# EAGLE design Schatten3 (EAGLE 6.5.0)
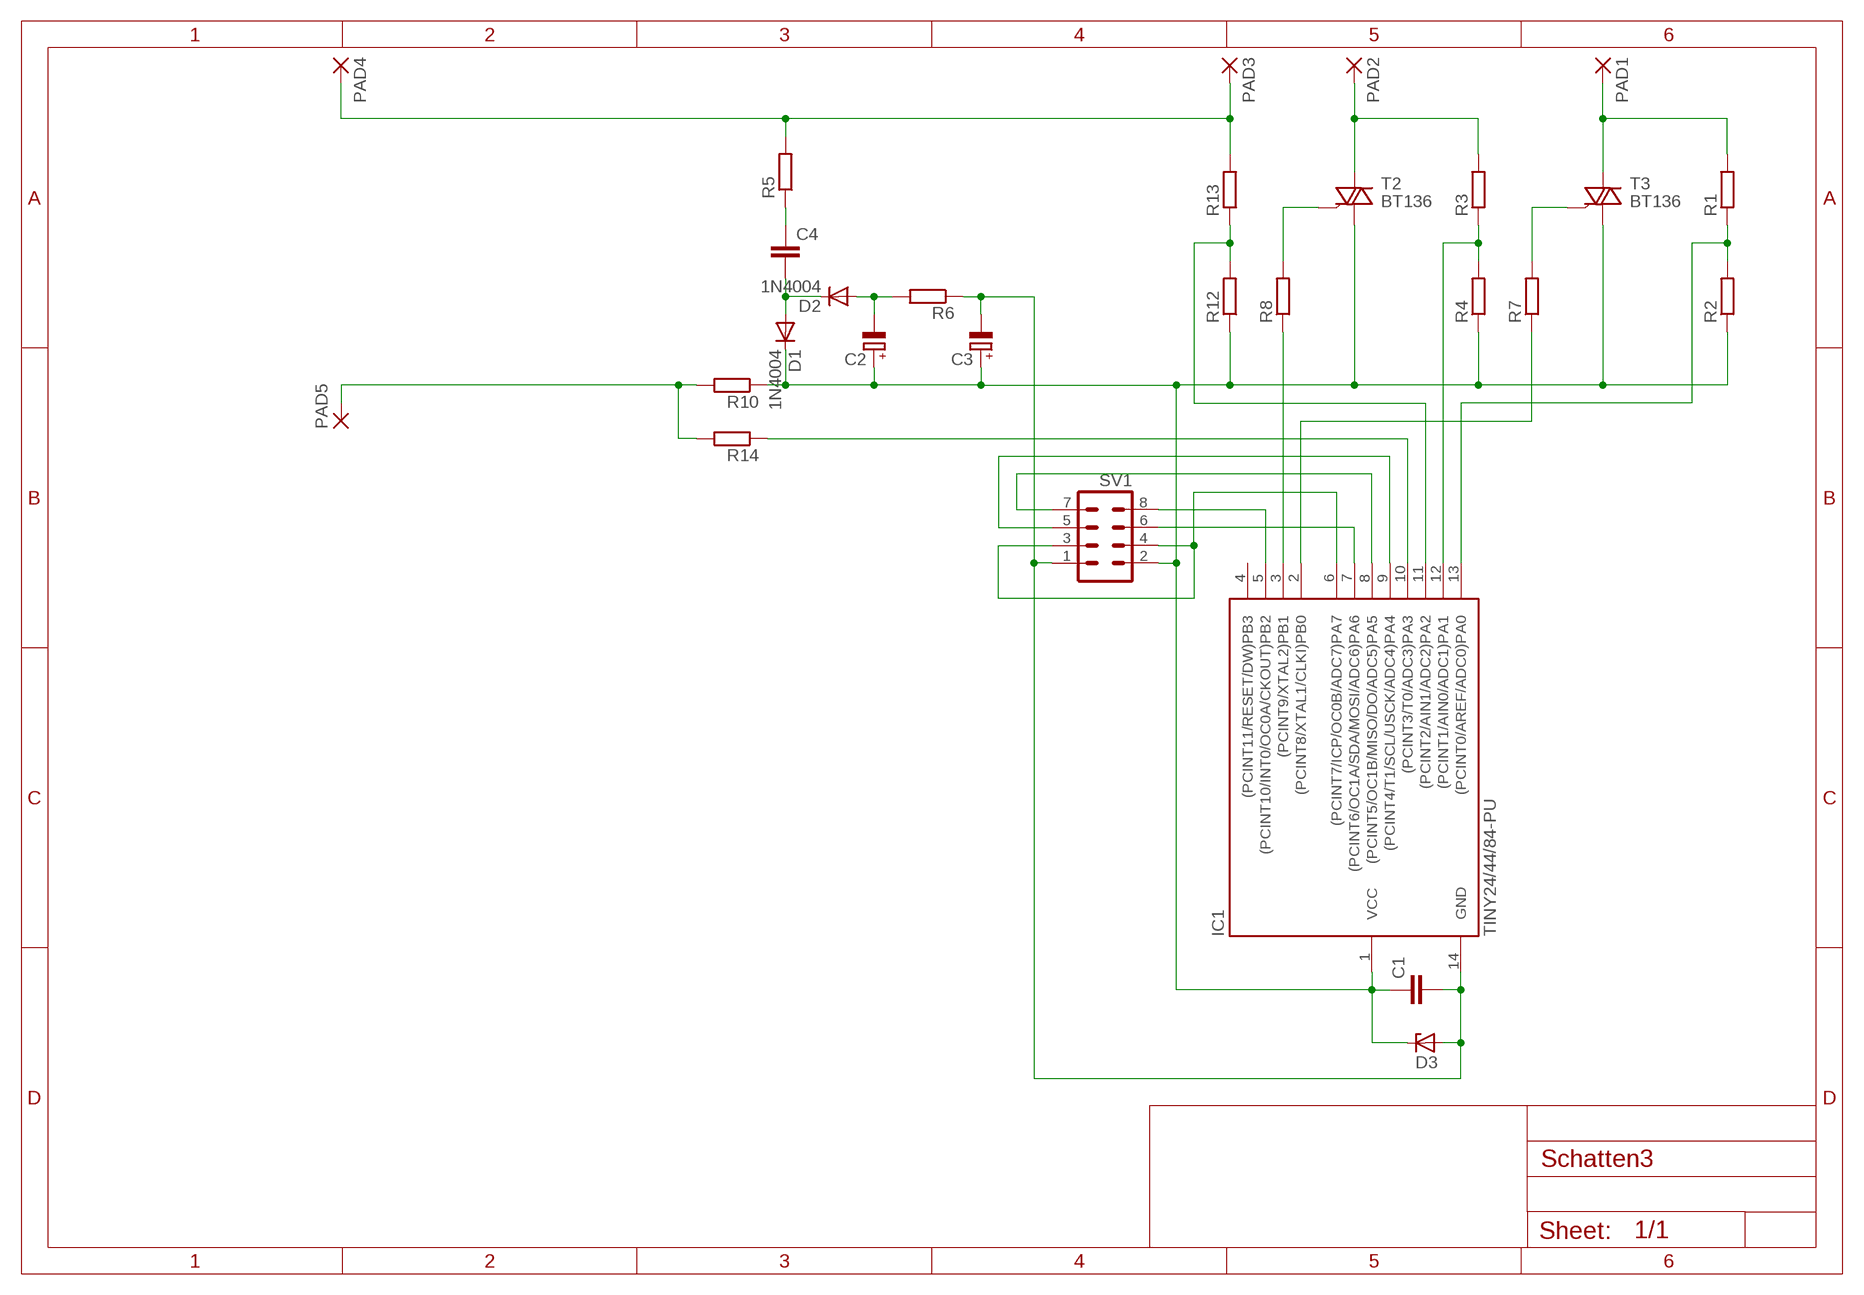
[diagram p0: schematic, sheet 1]

## Parts
C1  C-EUC3225  [C3225]
C2  CPOL-EUE5-8.5  [E5-8,5]
C3  CPOL-EUE5-8.5  [E5-8,5]
C4  C-EU150-064X183  [C150-064X183]
D1  1N4004  [DO41-10]
D2  1N4004  [DO41-10]
D3  ZENER-DIODEZD-7.5  [ZDIO-7.5]
IC1  TINY24/44/84-PU  [DIL14]
PAD1  1,6/0,9  [1,6/0,9]
PAD2  1,6/0,9  [1,6/0,9]
PAD3  1,6/0,9  [1,6/0,9]
PAD4  1,6/0,9  [1,6/0,9]
PAD5  1,6/0,9  [1,6/0,9]
R1  R-EU_0207/10  [0207/10]
R2  R-EU_0207/10  [0207/10]
R3  R-EU_0207/10  [0207/10]
R4  R-EU_0207/10  [0207/10]
R5  R-EU_0207/10  [0207/10]
R6  R-EU_0207/10  [0207/10]
R7  R-EU_0207/10  [0207/10]
R8  R-EU_0207/10  [0207/10]
R10  R-EU_0207/10  [0207/10]
R12  R-EU_0207/10  [0207/10]
R13  R-EU_0207/10  [0207/10]
R14  R-EU_0207/10  [0207/10]
SV1  MA04-2  [MA04-2]
T2  BT136  [TO220AB]
T3  BT136  [TO220AB]

## Nets
N$1: PAD5.1(P) R10.2 R14.2
N$2: IC1.13((PCINT0/AREF/ADC0)PA0) R1.1 R2.2
N$3: IC1.10((PCINT3/T0/ADC3)PA3) R14.1
N$4: IC1.7((PCINT6/OC1A/SDA/MOSI/ADC6)PA6) SV1.6
N$5: IC1.12((PCINT1/AIN0/ADC1)PA1) R3.1 R4.2
N$6: IC1.2((PCINT8/XTAL1/CLKI)PB0) R7.1
N$7: PAD1.1(P) R1.2 T3.2(A2)
N$8: PAD2.1(P) R3.2 T2.2(A2)
N$9: IC1.3((PCINT9/XTAL2)PB1) R8.1
N$10: IC1.8((PCINT5/OC1B/MISO/DO/ADC5)PA5) SV1.7
N$11: R8.2 T2.3(G)
N$12: R7.2 T3.3(G)
N$13: IC1.11((PCINT2/AIN1/ADC2)PA2) R12.2 R13.1
N$14: IC1.9((PCINT4/T1/SCL/USCK/ADC4)PA4) SV1.5
N$15: IC1.5((PCINT10/INT0/OC0A/CKOUT)PB2) SV1.8
N$16: IC1.6((PCINT7/ICP/OC0B/ADC7)PA7) SV1.3 SV1.4
N$17: PAD3.1(P) PAD4.1(P) R5.2 R13.2
N$18: C1.1 C2.+ C3.+ D1.C D3.C IC1.1(VCC) R2.1 R4.1 R10.1 R12.1 SV1.2 T2.1(A1) T3.1(A1)
N$19: C4.1 R5.1
N$20: C4.2 D1.A D2.C
N$21: C2.- D2.A R6.2
N$22: C1.2 C3.- D3.A IC1.14(GND) R6.1 SV1.1
Unconnected: IC1.4((PCINT11/RESET/DW)PB3)

## Library data of the parts
C1 C4 = rcl:C-EU: CAPACITOR, European symbol
C2 C3 = rcl:CPOL-EU: POLARIZED CAPACITOR, European symbol
D1 D2 = diode:1N4004: DIODE general purpose rectifier, 1 A
D3 = diode:ZENER-DIODE: Z-Diode
IC1 = avr-5-4.16:TINY24/44/84
PAD1-PAD5 = wirepad:1,6/0,9: THROUGH-HOLE PAD
R1-R8 R10 R12-R14 = rcl:R-EU_: RESISTOR, European symbol
SV1 = con-lstb:MA04-2: PIN HEADER; OC_FARNELL: unknown; OC_NEWARK: unknown
T2 T3 = triac:BT136: Triac BT136 series E sensitive gate Source: http://www.nxp.com/acrobat_download/datasheets/BT136_SERIES_E_2.pdf

## Board
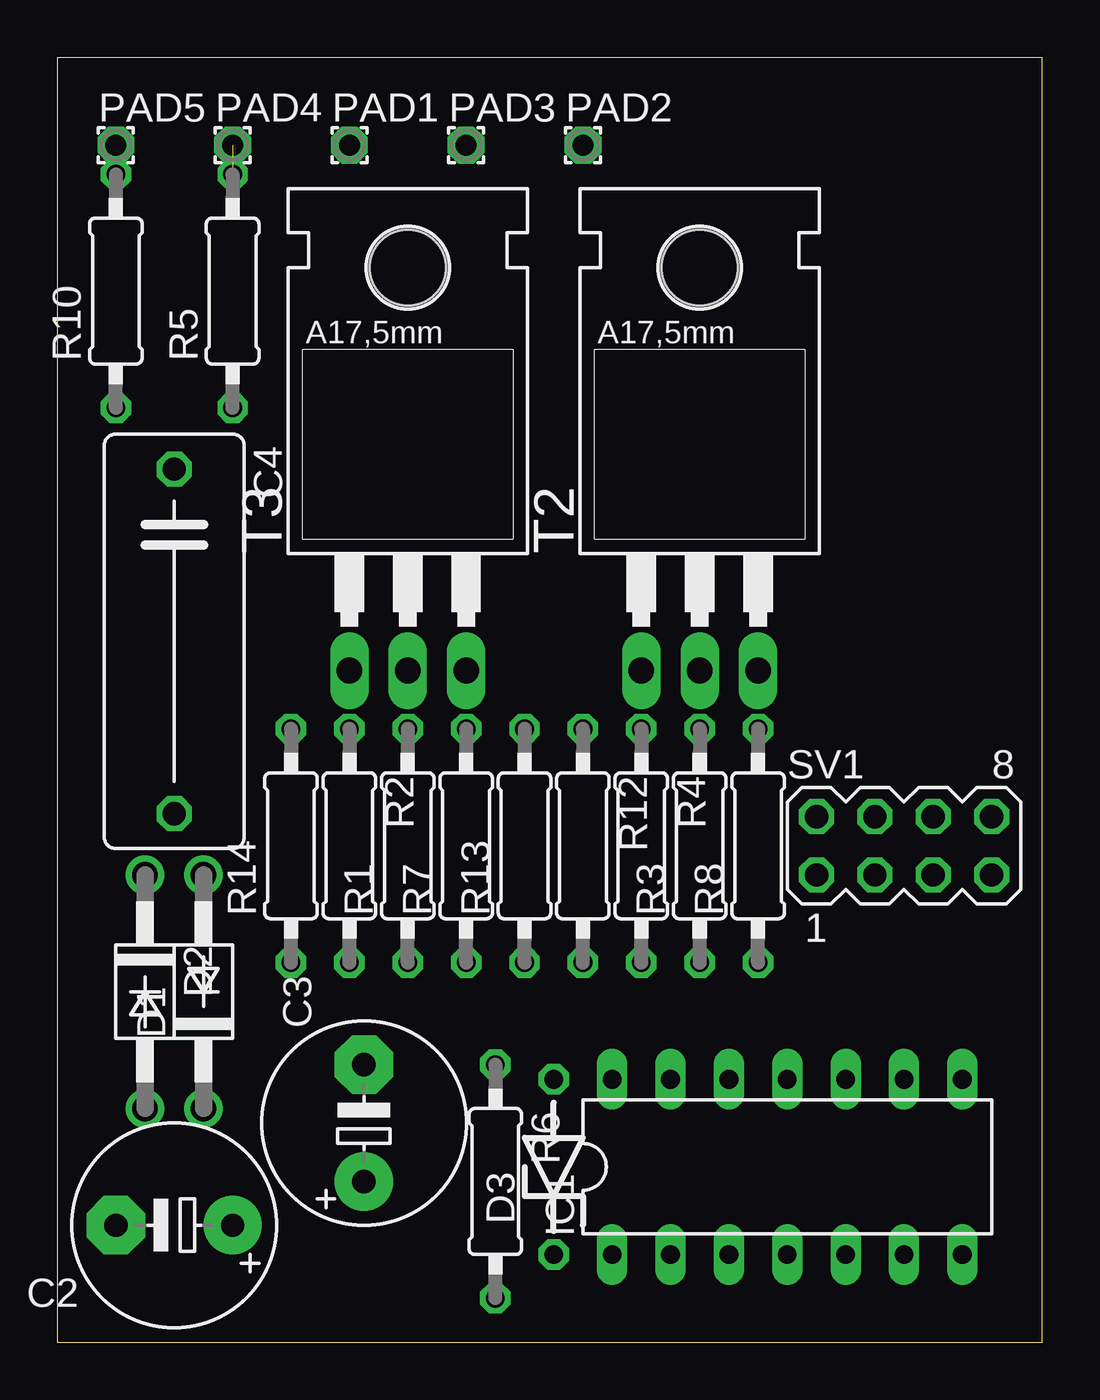
[diagram p1: board, top side]
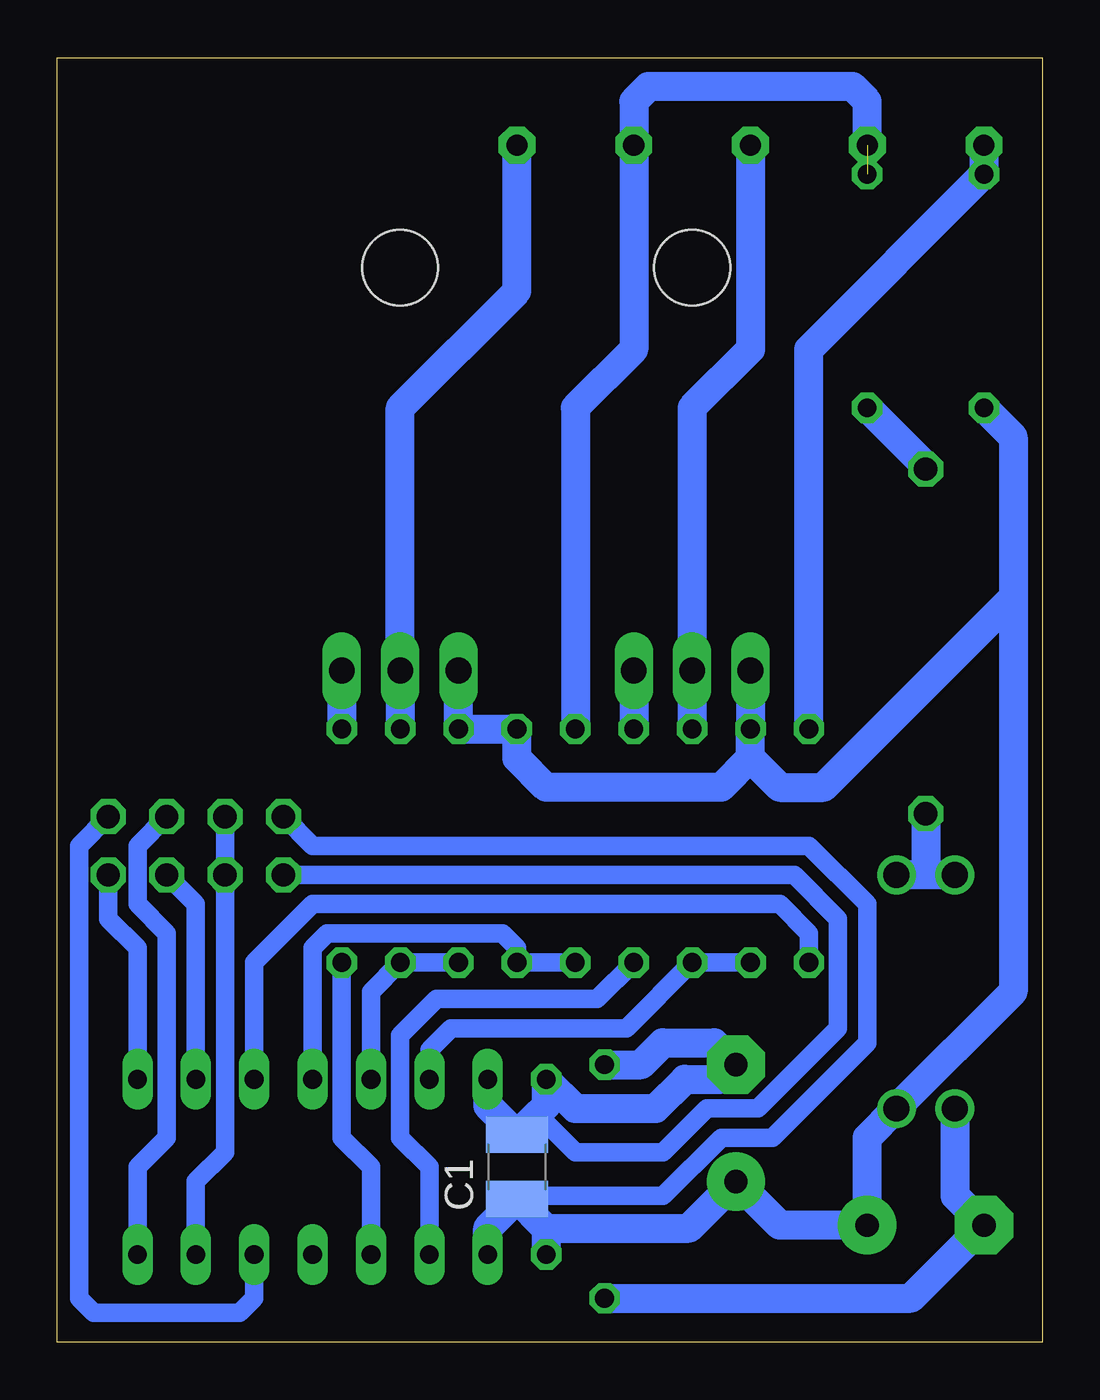
[diagram p2: board, bottom side, seen from below]

Size 42.85 x 55.87 mm. Coordinates in mm from the lower left corner, seen from the top.
Outline: 0,0 42.85,0 42.85,55.87 0,55.87 0,0
Copper layers (1*16): Top 0.035mm / dielectric 1.5mm / Bottom 0.035mm
Design rules "default": minimum track width 10mil, minimum drill 0.6mm, track to track 8mil, track to pad 8mil, pad to pad 8mil, via to via 8mil, smd to smd 8mil, copper to edge 40mil, drill to drill 8mil, minimum pad ring 10mil, minimum via ring 8mil, stop-mask expansion 4mil, vias tented up to drill 0mil, thermal gap 10mil

### Footprints (pad centres in the part's own frame; a part is rotated, then mirrored left to right if it is on the bottom)
C3225 = smd 1.6 x 2.7: 1 -1.4,0; 2 1.4,0
E5-8,5 = drill 1.016 pad 2.54: + -2.54,0 | drill 1.016 pad 2.54 octagon: - 2.54,0
C150-064X183 = drill 1.016 octagon: 1 -7.493,0; 2 7.493,0
DO41-10 = drill 1.118: A 5.08,0; C -5.08,0
ZDIO-7.5 = drill 0.813 octagon: A 3.81,0; C -3.81,0
DIL14 = drill 0.813 long: 1 -7.62,-3.81; 2 -5.08,-3.81; 3 -2.54,-3.81; 4 0,-3.81; 5 2.54,-3.81; 6 5.08,-3.81; 7 7.62,-3.81; 8 7.62,3.81; 9 5.08,3.81; 10 2.54,3.81; 11 0,3.81; 12 -2.54,3.81; 13 -5.08,3.81; 14 -7.62,3.81
1,6/0,9 = drill 0.914 pad 1.6 octagon: 1 0,0
0207/10 = drill 0.813 octagon: 1 -5.08,0; 2 5.08,0
MA04-2 = drill 1.016 octagon: 1 -3.81,-1.27; 2 -3.81,1.27; 3 -1.27,-1.27; 4 -1.27,1.27; 5 1.27,-1.27; 6 1.27,1.27; 7 3.81,-1.27; 8 3.81,1.27
TO220AB = drill 1.118 long: 1 -2.54,-6.35; 2 0,-6.35; 3 2.54,-6.35 | hole 3.302: 0,11.176

### Placement (x,y rotation side)
C1  22.86,7.62 90 bottom
C2  5.08,5.08 180 top
C3  13.34,9.53 90 top
C4  5.08,30.48 270 top
D1  6.35,15.24 90 top
D2  3.81,15.24 270 top
D3  21.59,7.62 90 top
IC1  31.75,7.62 0 top
PAD1  12.7,52.07 0 top
PAD2  22.86,52.07 0 top
PAD3  17.78,52.07 0 top
PAD4  7.62,52.07 0 top
PAD5  2.54,52.07 0 top
R1  15.24,21.59 90 top
R2  12.7,21.59 270 top
R3  27.94,21.59 90 top
R4  25.4,21.59 270 top
R5  7.62,45.72 90 top
R6  19.05,6.99 270 top
R7  17.78,21.59 90 top
R8  30.48,21.59 90 top
R10  2.54,45.72 90 top
R12  22.86,21.59 270 top
R13  20.32,21.59 90 top
R14  10.16,21.59 90 top
SV1  36.83,21.59 0 top
T2  27.94,35.56 0 top
T3  15.24,35.56 0 top

### Tracks (layer width: path | path; a pad name or v marks a point on that pad's centre or on a via)
N$1
  Bottom 1.27: PAD5.1 R10.2 10.16,43.18 R14.2
N$2
  Bottom 0.813: R2.2 R1.1 18.1,13.65 25.72,13.65 26.67,12.7 IC1.13
N$3
  Bottom 0.813: IC1.10 34.29,16.51 31.75,19.05 11.43,19.05 10.16,17.78 R14.1
N$4
  Bottom 0.813: IC1.7 39.37,7.62 38.1,8.89 38.1,17.78 39.37,19.05 39.37,21.59 SV1.6
N$5
  Bottom 0.813: R4.2 R3.1 29.21,15.24 IC1.12
N$6
  Bottom 0.813: IC1.2 26.67,7.62 27.94,8.89 27.94,13.34 26.35,14.92 19.37,14.92 R7.1
N$7
  Bottom 1.27: R1.2 T3.2 15.24,40.64 12.7,43.18 PAD1.1
N$8
  Bottom 1.27: R3.2 T2.2 27.94,40.64 22.86,45.72 PAD2.1
N$9
  Bottom 0.813: IC1.3 29.21,7.62 30.48,8.89 R8.1
N$10
  Bottom 0.813: IC1.8 39.37,17.14 40.64,18.41 SV1.7
N$11
  Bottom 1.27: T2.3 R8.2
N$12
  Bottom 1.27: T3.3 R7.2
N$13
  Bottom 0.813: R13.1 R12.2 22.86,17.14 23.5,17.78 31.11,17.78 31.75,17.14 IC1.11
N$14
  Bottom 0.813: IC1.9 36.83,19.05 SV1.5
N$15
  Bottom 0.813: SV1.8 41.91,21.59 41.91,1.91 41.27,1.27 34.92,1.27 34.29,1.91 IC1.5
N$16
  Bottom 0.813: IC1.6 36.83,6.99 35.56,8.26 SV1.3 SV1.4
N$17  (1 unrouted)
  Bottom 1.27: PAD4.1 7.62,53.98 8.26,54.61 17.14,54.61 17.78,53.98 PAD3.1 17.78,43.18 20.32,40.64 R13.2
N$18
  Bottom 0.813: C1.1 22.73,6.35 16.51,6.35 13.97,8.89 11.75,8.89 7.62,13.02 7.62,19.05 10.16,21.59 31.75,21.59 SV1.2
  Bottom 1.27: IC1.1 24.13,4.95 C1.1 21.59,4.95 | T3.1 R2.1 12.7,25.4 | 12.7,25.4 13.97,24.13 21.59,24.13 22.86,25.4 R12.1 R4.1 T2.1 | 21.59,4.95 D3.C | 12.7,25.4 11.43,24.13 9.53,24.13 1.27,32.38 | 21.59,4.95 15.37,4.95 C3.+ 11.43,5.08 C2.+ 7.62,8.89 D1.C 1.27,15.24 1.27,32.38 | R10.1 1.27,39.37 1.27,32.38
N$19
  Bottom 1.27: C4.1 5.08,38.1 R5.1
N$20
  Bottom 1.27: D2.C 5.08,20.32 | 5.08,20.32 D1.A | C4.2 5.08,20.32
N$21
  Bottom 1.27: R6.2 5.71,1.91 C2.- 3.81,6.35 D2.A
N$22
  Bottom 0.813: SV1.1 10.79,20.32 8.89,18.41 8.89,13.65 12.38,10.16 14.61,10.16 16.51,8.26 20.32,8.26 21.97,9.91
  Bottom 1.27: IC1.14 24.13,10.29 C1.2 21.97,9.91 21.59,10.29 D3.A 20.32,10.16 16.83,10.16 15.56,11.43 13.97,11.43 C3.- 14.29,13.02 16.51,13.02 17.46,12.06 R6.1